# EAGLE design 555 (EAGLE 6.5.0)
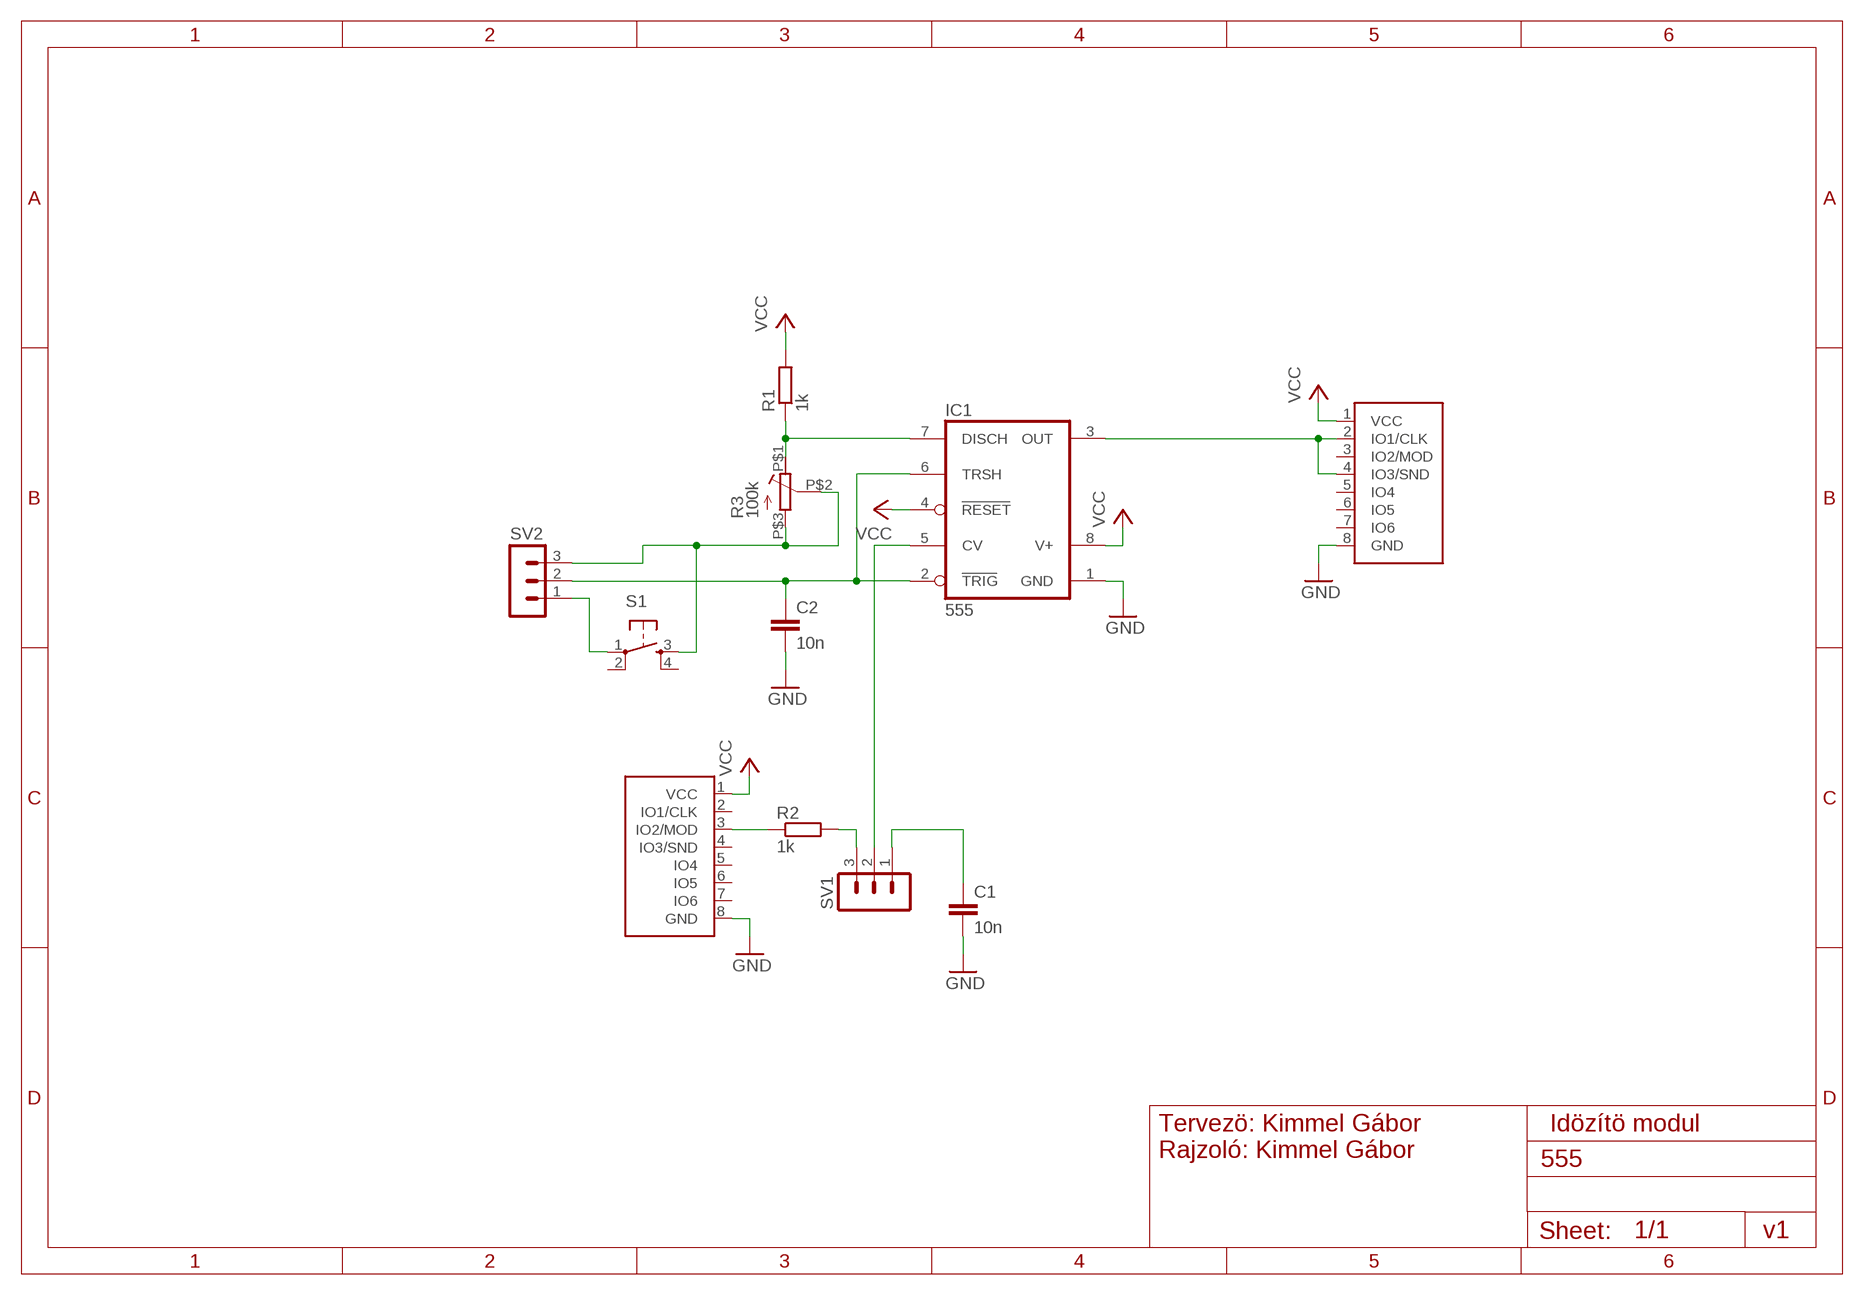
[diagram p0: schematic, sheet 1]

## Parts
C1  10n  C-EU075-032X103  [C075-032X103]
C2  10n  C-EU075-032X103  [C075-032X103]
IC1  555  ICM7555  [DIL08]
R1  1k  R-EU_0309/12  [0309/12]
R2  1k  R-EU_0309/12  [0309/12]
R3  100k  GANZ_POTI  [GANZ_POT]
S1  TAC_SWITCHPTH  [TACTILE-PTH]
SV1  MA03-1  [MA03-1]
SV2  MA03-1  [MA03-1]
U$2  ó  GANZ-CONNECTOR  [FE08W]
U$3  GANZ-CONNECTOR-OUT  [MA08-1W]

## Nets
GND: C1.2 C2.2 IC1.1(GND) U$2.8(GND) U$3.8(GND)
N$1: IC1.7(DISCH) R1.1 R3.P$1(A)
N$2: R3.P$2(S) R3.P$3(E) S1.3 SV2.3
N$3: IC1.3(OUT) U$3.2(IO1/CLK) U$3.4(IO3/SND)
N$4: IC1.5(CV) SV1.2
N$5: S1.1 SV2.1
N$6: C1.1 SV1.1
N$7: R2.1 U$2.3(IO2/MOD)
N$8: C2.1 IC1.2(TRIG) IC1.6(TRSH) SV2.2
N$9: R2.2 SV1.3
VCC: IC1.4(RESET) IC1.8(V+) R1.2 U$2.1(VCC) U$3.1(VCC)
Unconnected: S1.2 S1.4 U$2.2(IO1/CLK) U$2.4(IO3/SND) U$2.5(IO4) U$2.6(IO5) U$2.7(IO6) U$3.3(IO2/MOD) U$3.5(IO4) U$3.6(IO5) U$3.7(IO6)

## Notes on the sheet
- Tervezö: Kimmel Gábor
  Rajzoló: Kimmel Gábor
- Idözítö modul
- v1

## Library data of the parts
C1 C2 = resistor:C-EU: CAPACITOR, European symbol
IC1 = maxim:ICM7555: TIMER; MF: MAXIM; MPN: ICM7555IPA+; OC_FARNELL: 9663762; OC_NEWARK: 68K4387
R1 R2 = resistor:R-EU_: RESISTOR, European symbol
R3 = ganz_pot:GANZ_POTI
S1 = SparkFun-Electromechanical:TAC_SWITCH: Momentary Switch Button commonly used for reset or general input. Spark Fun Electronics SKU : COM-00097 SMT- SWCH-08247
SV1 SV2 = con-lstb:MA03-1: PIN HEADER; OC_FARNELL: unknown; OC_NEWARK: unknown
U$2 = ganzlib:GANZ-CONNECTOR
U$3 = ganzlib:GANZ-CONNECTOR-OUT

## Board
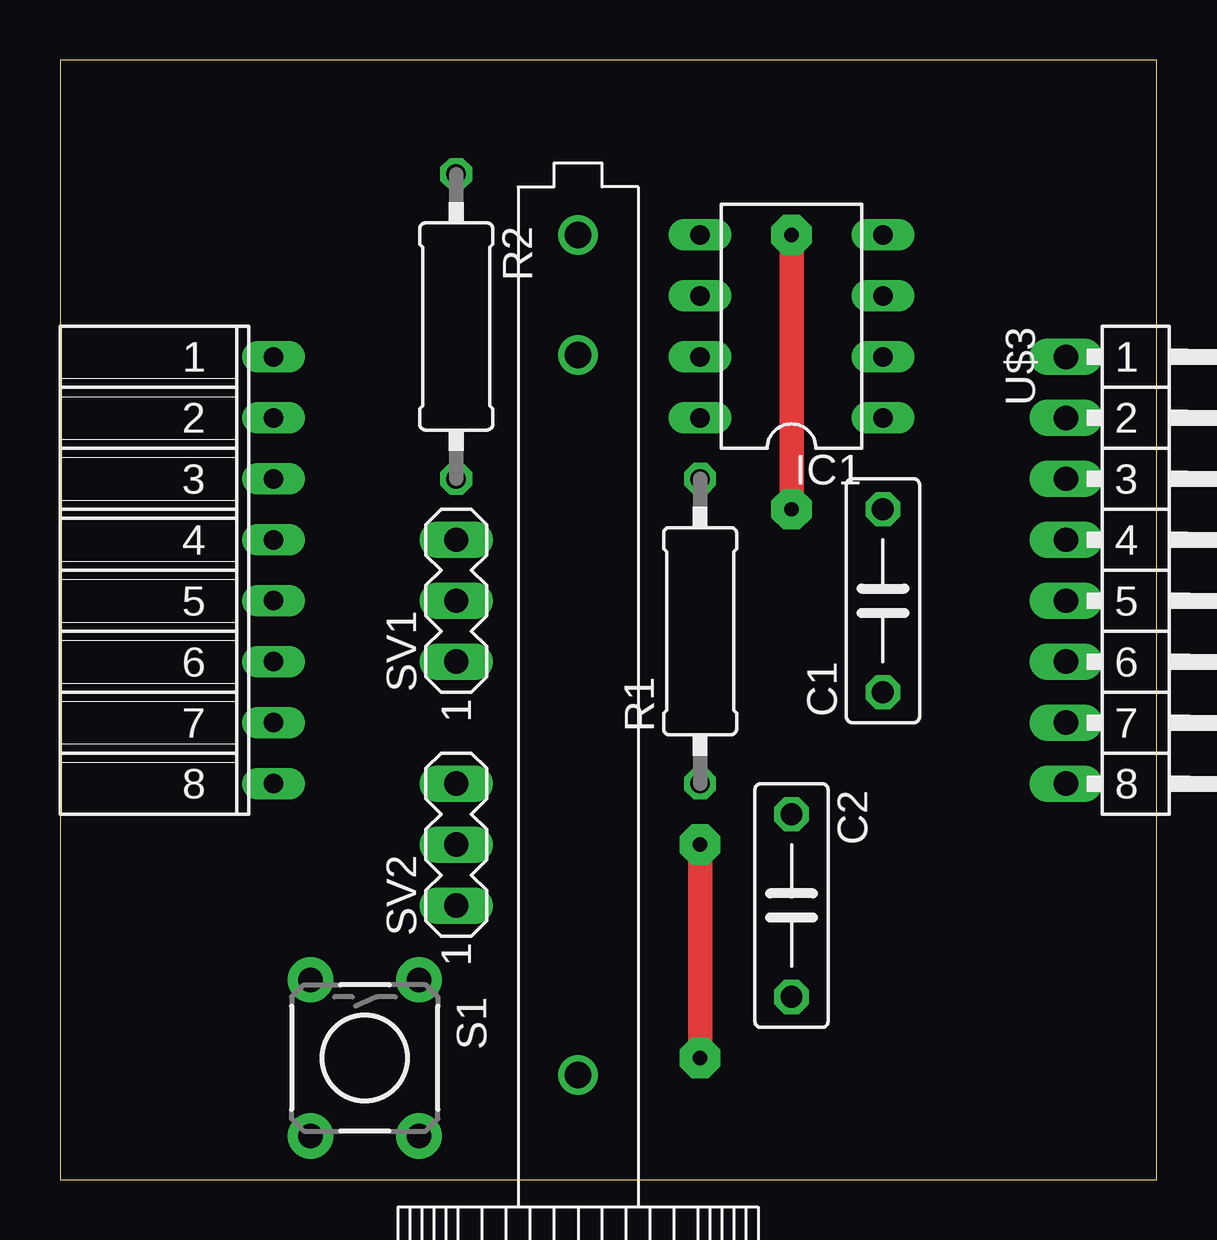
[diagram p1: board, top side]
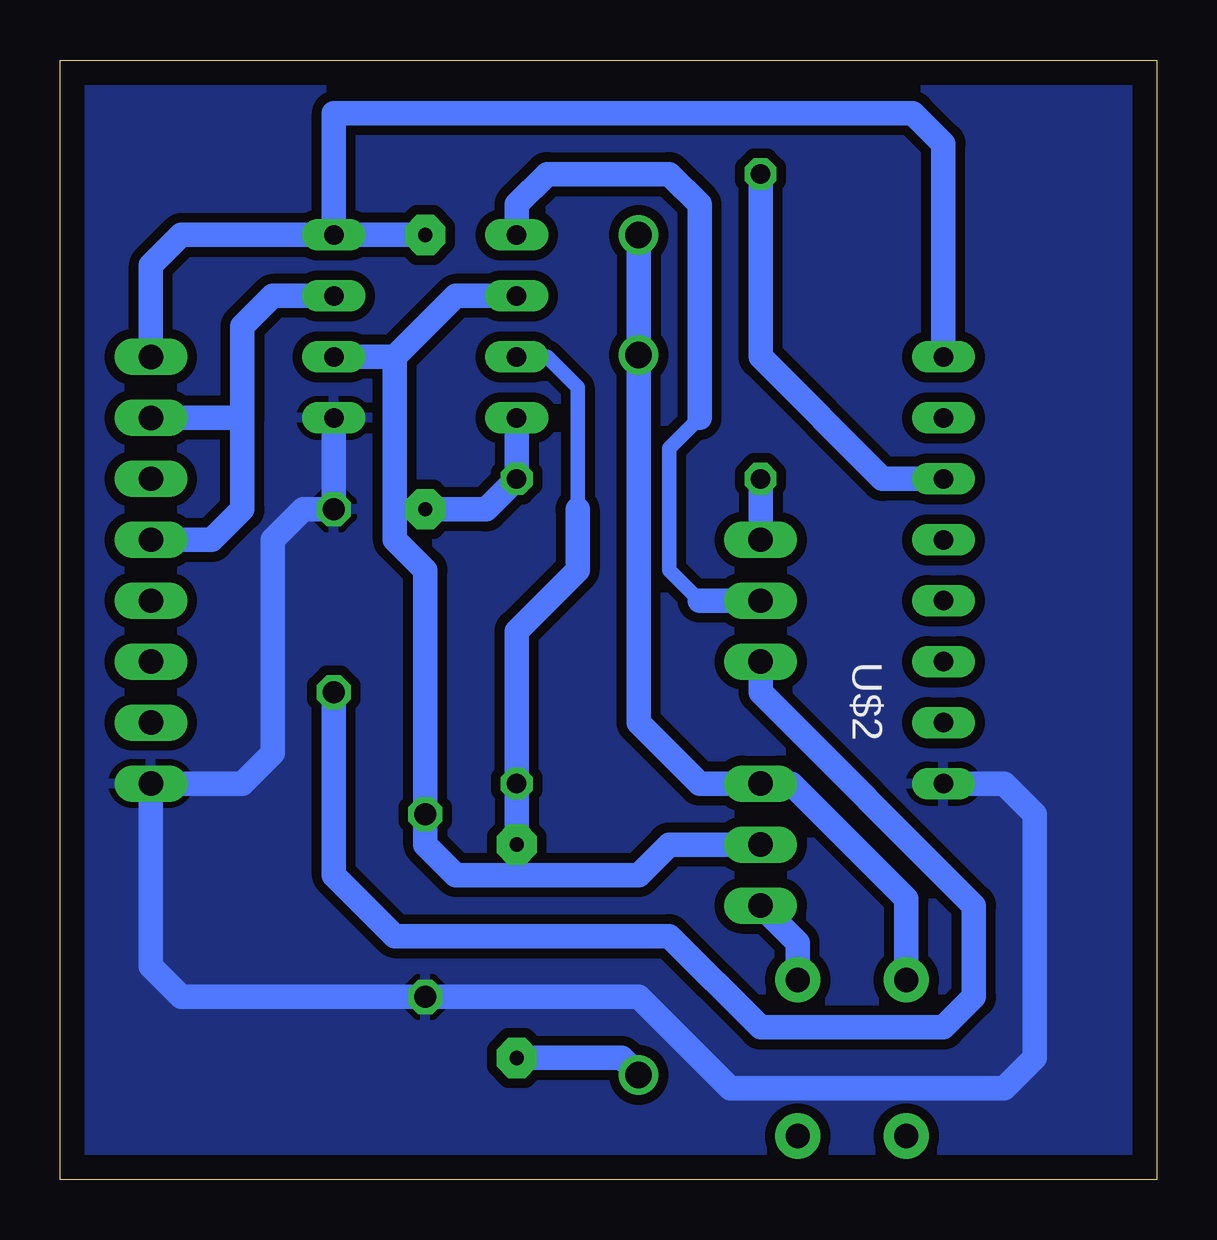
[diagram p2: board, bottom side, seen from below]

Size 45.7 x 46.66 mm. Coordinates in mm from the lower left corner, seen from the top.
Outline: 0,0 45.7,0 45.7,46.66 0,46.66 0,0
Copper layers (1*16): Top 0.035mm / dielectric 1.5mm / Bottom 0.035mm
Design rules "default *": minimum track width 10mil, minimum drill 24mil, track to track 8mil, track to pad 8mil, pad to pad 8mil, via to via 8mil, smd to smd 8mil, copper to edge 40mil, drill to drill 8mil, minimum pad ring 10mil, minimum via ring 8mil, stop-mask expansion 4mil, vias tented up to drill 0mil, thermal gap 10mil

### Footprints (pad centres in the part's own frame; a part is rotated, then mirrored left to right if it is on the bottom)
C075-032X103 = drill 0.914 octagon: 1 -3.81,0; 2 3.81,0
DIL08 = drill 0.813 long: 1 -3.81,-3.81; 2 -1.27,-3.81; 3 1.27,-3.81; 4 3.81,-3.81; 5 3.81,3.81; 6 1.27,3.81; 7 -1.27,3.81; 8 -3.81,3.81
0309/12 = drill 0.813 octagon: 1 -6.35,0; 2 6.35,0
GANZ_POT = drill 1.1: P$1 -35,0; P$2 0,0; P$3 -5,0
TACTILE-PTH = drill 1.016 pad 1.88: 1 -3.251,2.261; 2 3.251,2.261; 3 -3.251,-2.261; 4 3.251,-2.261
MA03-1 = drill 1.016 long: 1 -2.54,0; 2 0,0; 3 2.54,0
FE08W = drill 0.813 long: 1 5.08,8.89; 2 5.08,6.35; 3 5.08,3.81; 4 5.08,1.27; 5 5.08,-1.27; 6 5.08,-3.81; 7 5.08,-6.35; 8 5.08,-8.89
MA08-1W = drill 1.016 long: 1 0,8.89; 2 0,6.35; 3 0,3.81; 4 0,1.27; 5 0,-1.27; 6 0,-3.81; 7 0,-6.35; 8 0,-8.89

### Placement (x,y rotation side)
C1  34.29,24.13 90 top
C2  30.48,11.43 270 top
IC1  30.48,35.56 90 top
R1  26.67,22.86 90 top
R2  16.51,35.56 270 top
R3  21.59,39.37 90 top
S1  12.7,5.08 270 top
SV1  16.51,24.13 90 top
SV2  16.51,13.97 90 top
U$2  3.81,25.4 0 top
U$3  41.91,25.4 0 top

### Tracks (layer width: path | path; a pad name or v marks a point on that pad's centre or on a via)
GND
  Bottom 1.016: IC1.1 C1.2 35.56,27.94 36.83,26.67 36.83,17.78 38.1,16.51 U$3.8 41.91,8.89 40.64,7.62 C2.2 21.59,7.62 17.78,3.81 6.35,3.81 5.08,5.08 5.08,15.24 6.35,16.51 U$2.8
  pour Bottom (isolate 0.406): 45.72,0 0,0 0,46.99 45.72,46.99
N$1  (via drill 0.6 pad 1.68)
  Top 1.016: v26.67,13.97 v26.67,5.08
  Bottom 0.61: IC1.7 25.4,34.29 24.13,33.02 24.13,27.94
  Bottom 1.016: v26.67,13.97 R1.1 26.67,22.86 24.13,25.4 24.13,27.94 | v26.67,5.08 22.3,5.08 R3.P$1
N$2
  Bottom 1.016: R3.P$2 R3.P$3 21.59,19.05 19.05,16.51 SV2.3 15.24,16.51 10.44,11.71 S1.3
N$3
  Bottom 1.016: IC1.3 36.83,36.83 38.1,35.56 38.1,31.75 | 38.1,31.75 U$3.2 | U$3.4 39.37,26.67 38.1,27.94 38.1,31.75
N$4
  Bottom 0.61: 19.05,24.13 20.32,25.4 20.32,30.48 19.05,31.75
  Bottom 1.016: IC1.5 26.67,40.64 25.4,41.91 20.32,41.91 19.05,40.64 19.05,31.75 | SV1.2 19.05,24.13
N$5
  Bottom 1.016: S1.1 14.96,9.88 SV2.1
N$6
  Bottom 1.016: C1.1 34.29,12.7 31.75,10.16 20.32,10.16 16.51,6.35 8.89,6.35 7.62,7.62 7.62,11.43 16.51,20.32 SV1.1
N$7
  Bottom 1.016: U$2.3 11.43,29.21 16.51,34.29 R2.1
N$8
  Bottom 1.016: IC1.6 29.21,36.83 31.75,34.29 | 31.75,34.29 IC1.2 | SV2.2 20.32,13.97 21.59,12.7 29.21,12.7 30.48,13.97 C2.1 30.48,25.4 31.75,26.67 31.75,34.29
N$9
  Bottom 1.016: R2.2 SV1.3
VCC  (via drill 0.6 pad 1.68)
  Top 1.016: v30.48,27.94 v30.48,39.37
  Bottom 1.016: IC1.8 R1.2 27.94,27.94 v30.48,27.94 | U$2.1 8.89,43.18 10.16,44.45 34.29,44.45 IC1.4 v30.48,39.37 40.64,39.37 41.91,38.1 U$3.1